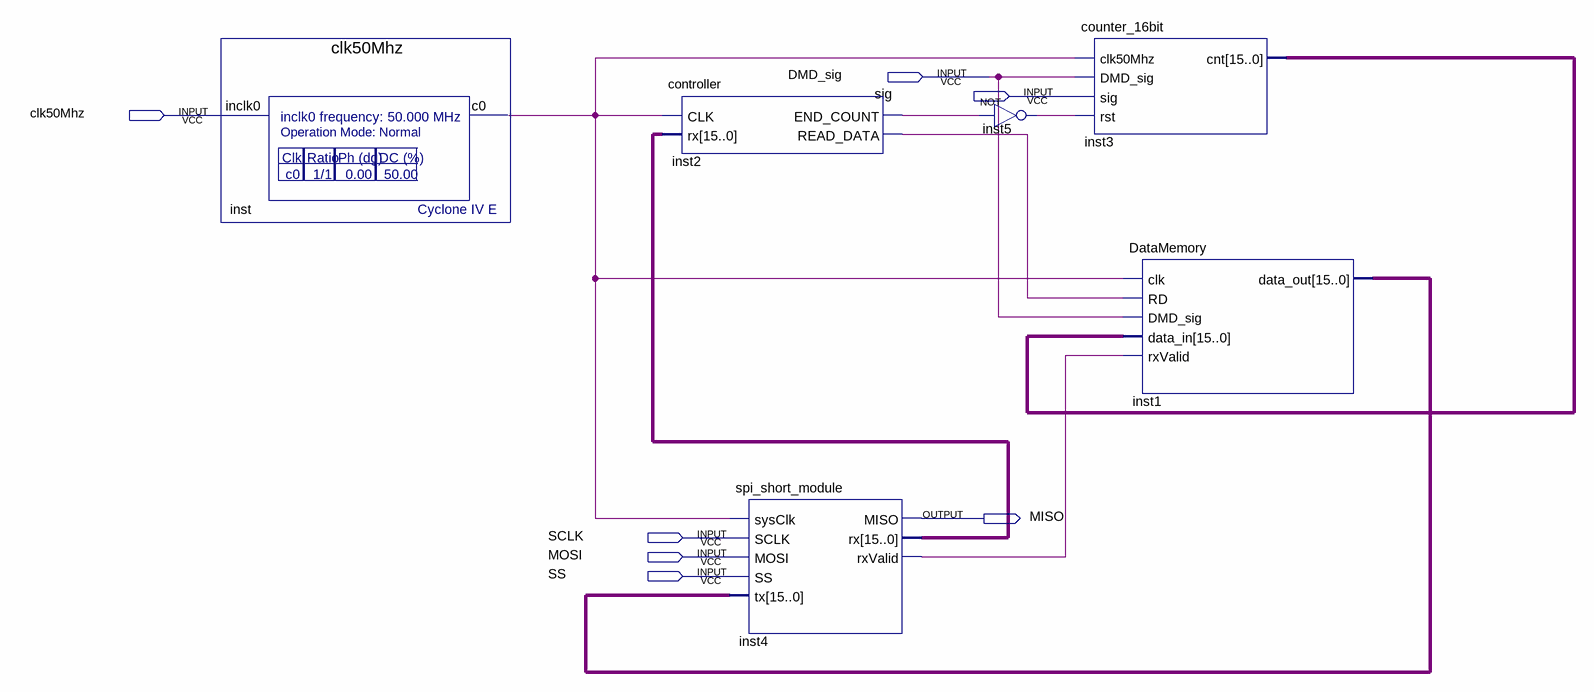
[diagram p0: schematic sheet]
// Quartus schematic fpga_only_controller.bdf as structural Verilog: 6 symbols, 7 pins
module fpga_only_controller (
  input  DMD_sig,
  input  sig,
  input  clk50Mhz,
  input  SCLK,
  input  MOSI,
  input  SS,
  output MISO
);

  wire inst2_end_count, inst2_read_data, inst4_rxvalid, inst5_out, inst_c0;
  wire [15:0] inst1_data_out, inst3_cnt, inst4_rx;

  clk50Mhz inst (.c0(inst_c0));  // open: inclk0
  controller inst2 (.CLK(inst_c0), .rx(inst4_rx), .END_COUNT(inst2_end_count), .READ_DATA(inst2_read_data));
  spi_short_module inst4 (
    .sysClk(inst_c0), .tx(inst1_data_out), .MISO(MISO), .rx(inst4_rx), .rxValid(inst4_rxvalid));  // open: SCLK, MOSI, SS
  not inst5 (inst5_out, inst2_end_count);
  counter_16bit inst3 (.clk50Mhz(inst_c0), .DMD_sig(DMD_sig), .sig(sig), .rst(inst5_out), .cnt(inst3_cnt));
  DataMemory inst1 (
    .clk(inst_c0), .RD(inst2_read_data), .DMD_sig(DMD_sig), .data_in(inst3_cnt), .rxValid(inst4_rxvalid),
    .data_out(inst1_data_out));
endmodule
